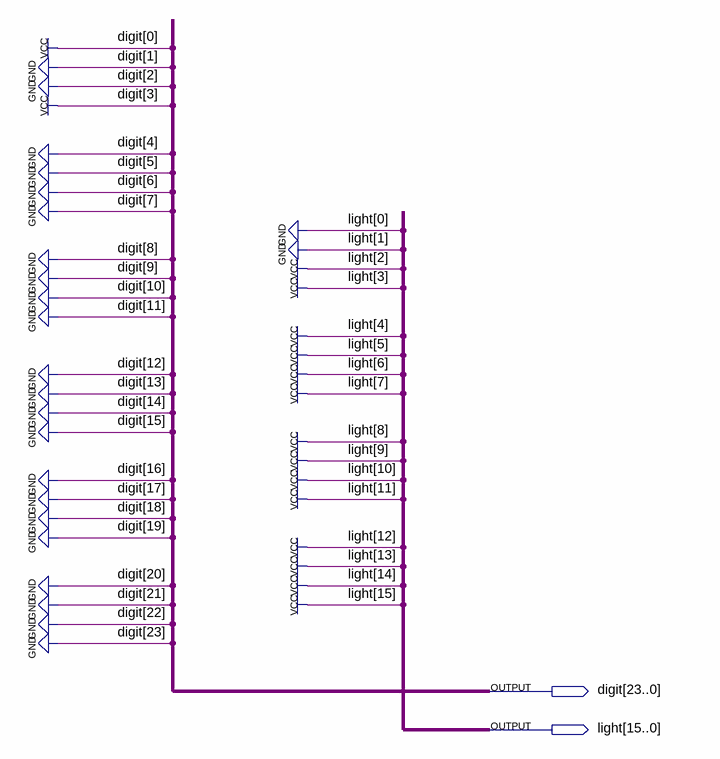
[diagram p0: schematic sheet]
// Quartus schematic Pattern_2_Frame_8.bdf as structural Verilog: 0 symbols, 2 pins
module Pattern_2_Frame_8 (
  output [23:0] digit,
  output [15:0] light
);


  assign digit = 24'b000000000000000000001001;
  assign light = 16'b1111111111111100;
endmodule
